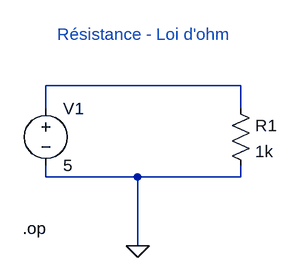
[diagram p0: schematic 01_Loi_Ohm_R1k.asc]
01_Loi_Ohm_R1k.asc, the LTspice schematic file:
Version 4.1
SHEET 1 1068 680
WIRE 240 80 -32 80
WIRE -32 112 -32 80
WIRE 240 112 240 80
WIRE -32 208 -32 192
WIRE 96 208 -32 208
WIRE 240 208 240 192
WIRE 240 208 96 208
WIRE 96 304 96 208
FLAG 96 304 0
SYMBOL voltage -32 96 R0
WINDOW 123 0 0 Left 0
WINDOW 39 0 0 Left 0
SYMATTR InstName V1
SYMATTR Value 5
SYMBOL res 224 96 R0
SYMATTR InstName R1
SYMATTR Value 1k
TEXT -64 280 Left 2 !.op
TEXT -16 8 Left 2 ;Résistance - Loi d'ohm

The netlist it stands for:
* 01_Loi_Ohm_R1k.asc
V1 N001 0 5
R1 N001 0 1k
.op
* Résistance - Loi d'ohm
.backanno
.end